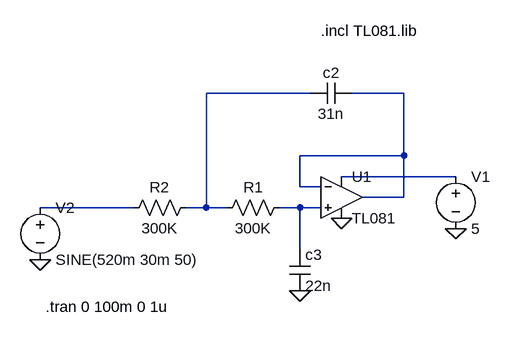
[diagram p0: schematic amplifiers.asc]
amplifiers.asc, the LTspice schematic file:
Version 4
SHEET 1 900 680
WIRE -48 -48 -208 -48
WIRE 96 -48 16 -48
WIRE 96 48 96 -48
WIRE 96 48 -64 48
WIRE 176 80 0 80
WIRE -64 96 -64 48
WIRE -32 96 -64 96
WIRE 96 112 96 48
WIRE 96 112 32 112
WIRE -320 128 -464 128
WIRE -208 128 -208 -48
WIRE -208 128 -240 128
WIRE -176 128 -208 128
WIRE -64 128 -96 128
WIRE -32 128 -64 128
WIRE -64 192 -64 128
FLAG 0 144 0
FLAG 176 160 0
FLAG -464 208 0
FLAG -64 256 0
SYMBOL Opamps\\opamp2 0 48 R0
SYMATTR InstName U1
SYMATTR Value TL081
SYMBOL res -80 112 R90
WINDOW 0 0 56 VBottom 2
WINDOW 3 32 56 VTop 2
SYMATTR InstName R1
SYMATTR Value 300K
SYMBOL res -224 112 R90
WINDOW 0 0 56 VBottom 2
WINDOW 3 32 56 VTop 2
SYMATTR InstName R2
SYMATTR Value 300K
SYMBOL cap -80 192 R0
SYMATTR InstName c3
SYMATTR Value 22n
SYMBOL cap 16 -64 R90
WINDOW 0 0 32 VBottom 2
WINDOW 3 32 32 VTop 2
SYMATTR InstName c2
SYMATTR Value 31n
SYMBOL voltage 176 64 R0
WINDOW 123 0 0 Left 0
WINDOW 39 0 0 Left 0
SYMATTR InstName V1
SYMATTR Value 5
SYMBOL voltage -464 112 R0
WINDOW 123 0 0 Left 0
WINDOW 39 0 0 Left 0
SYMATTR InstName V2
SYMATTR Value SINE(520m 30m 50)
TEXT -32 -144 Left 2 !.incl TL081.lib
TEXT -456 280 Left 2 !.tran 0 100m 0 1u

The netlist it stands for:
* amplifiers.asc
XU1 N005 N002 N003 0 N002 TL081  ; pins In+ In- V+ V- OUT
R1 N005 N001 300K
R2 N001 N004 300K
c3 N005 0 22n
c2 N002 N001 31n
V1 N003 0 5
V2 N004 0 SINE(520m 30m 50)
.incl TL081.lib
.tran 0 100m 0 1u
.backanno
.end